# Altium schematic sheet 03-CORE_BOARD.SchDoc
size B
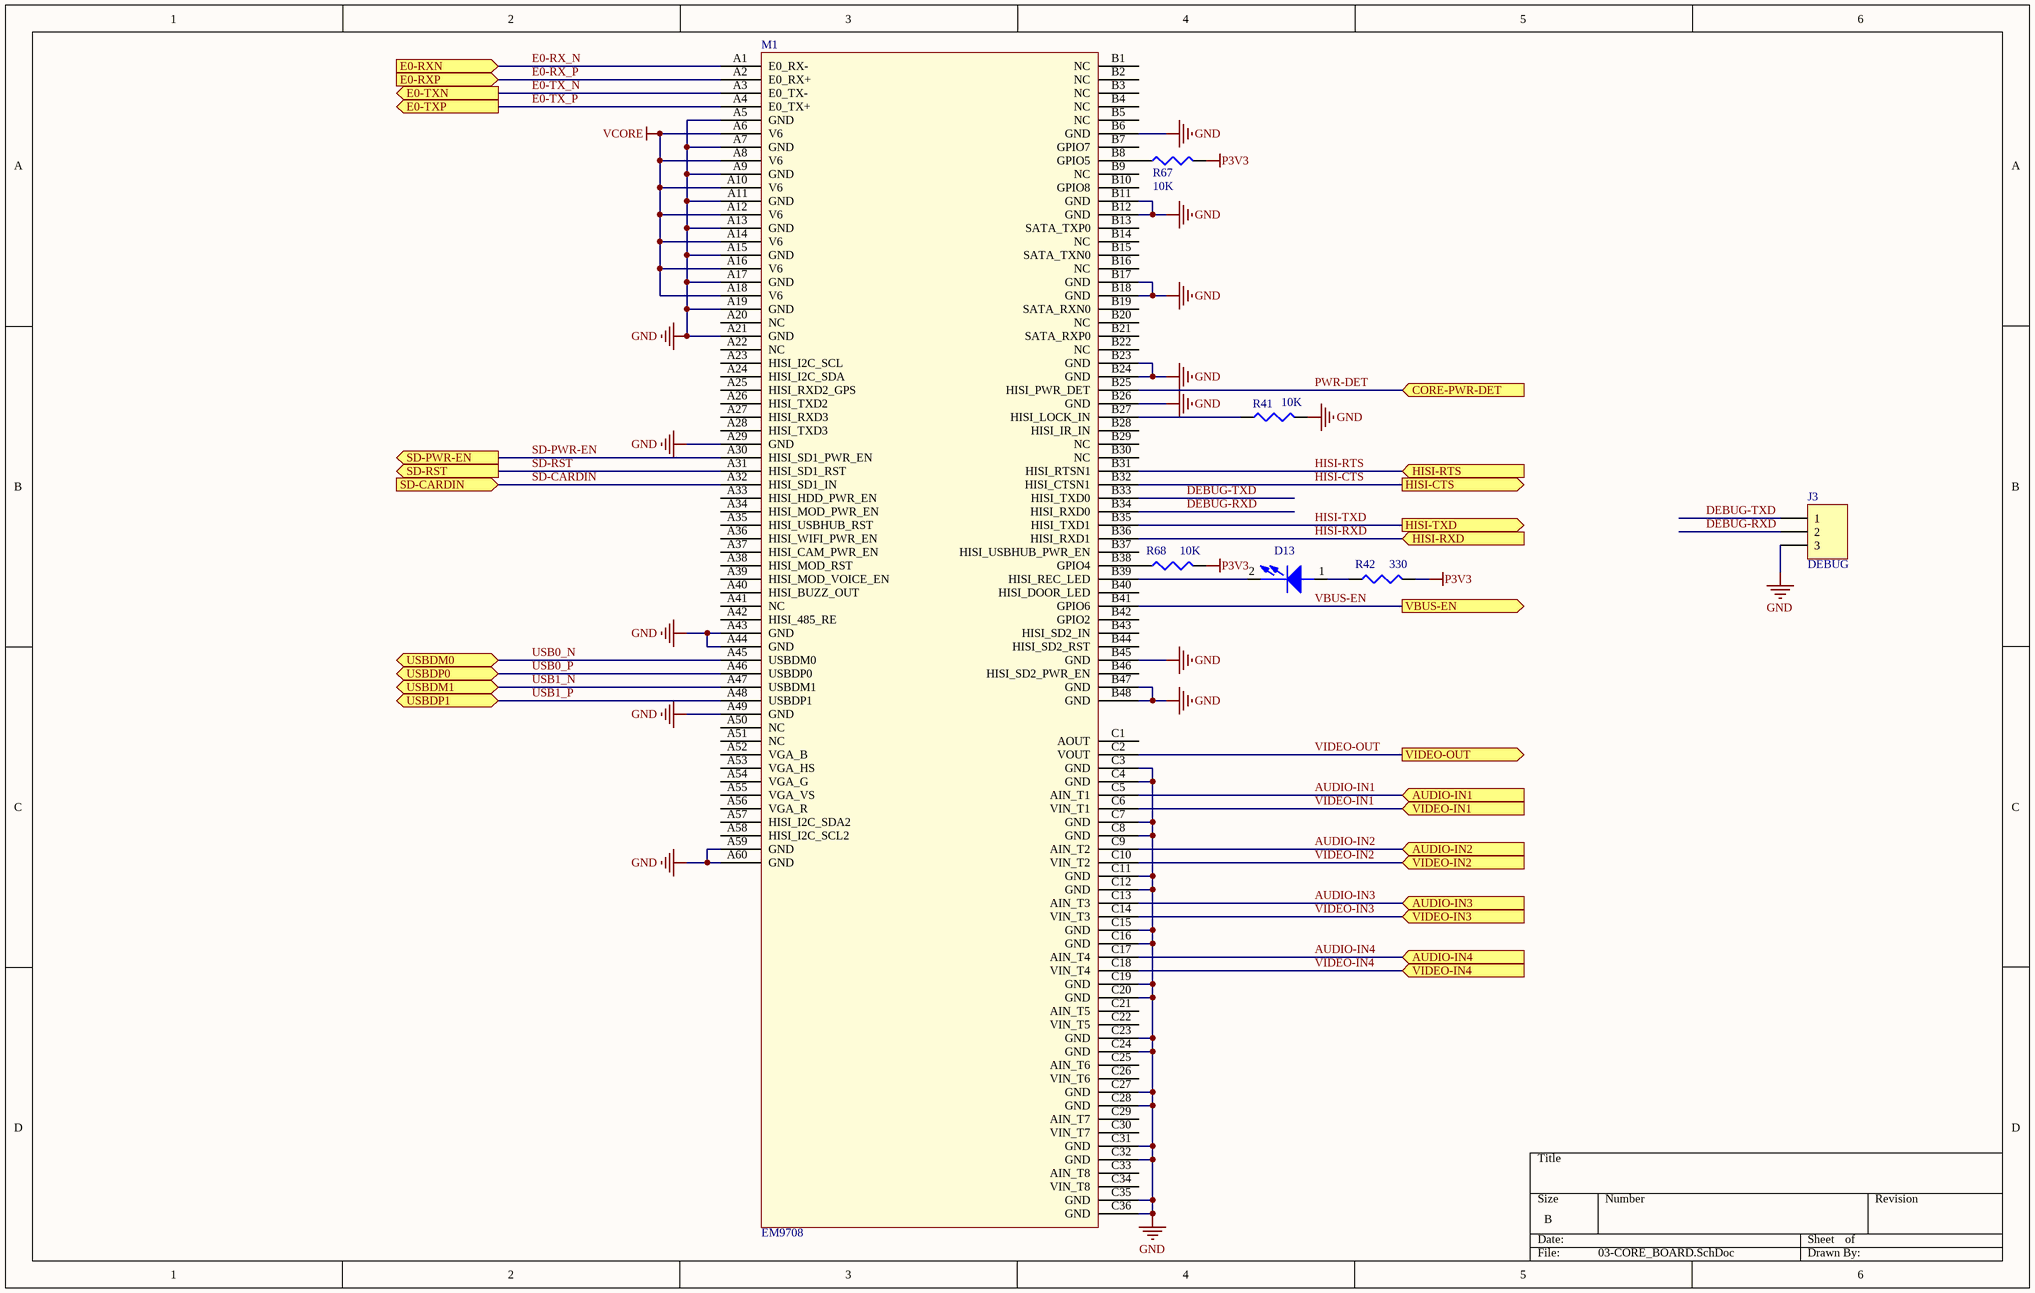
[diagram p0: 03-CORE_BOARD.SchDoc]

## Parts
D13  LED GREEN  [LED0603]  (value not drawn)
J3  DEBUG  [HDR1X3]
M1  EM9708  [EM9708]
R41  10K  [0402]
R42  330  [0402]
R67  10K  [0402]
R68  10K  [0402]

## Ports
AUDIO-IN1 (in), AUDIO-IN2 (in), AUDIO-IN3 (in), AUDIO-IN4 (in), CORE-PWR-DET (in), E0-RXN (in), E0-RXP (in), E0-TXN (out), E0-TXP (out), HISI-CTS (out), HISI-RTS (in), HISI-RXD (in), HISI-TXD (out), SD-CARDIN (in), SD-PWR-EN (out), SD-RST (out), USBDM0 (bidir), USBDM1, USBDP0 (bidir), USBDP1, VBUS-EN (out), VIDEO-IN1 (in), VIDEO-IN2 (in), VIDEO-IN3 (in), VIDEO-IN4 (in), VIDEO-OUT (out)

## Nets
GND: J3.3 M1.A5(GND) M1.A7(GND) M1.A9(GND) M1.A11(GND) M1.A13(GND) M1.A15(GND) M1.A17(GND) M1.A19(GND) M1.A21(GND) M1.A29(GND) M1.A43(GND) M1.A44(GND) M1.A49(GND) M1.A59(GND) M1.A60(GND) M1.B6(GND) M1.B11(GND) M1.B12(GND) M1.B17(GND) M1.B18(GND) M1.B23(GND) M1.B24(GND) M1.B26(GND) M1.B45(GND) M1.B47(GND) M1.B48(GND) M1.C3(GND) M1.C4(GND) M1.C7(GND) M1.C8(GND) M1.C11(GND) M1.C12(GND) M1.C15(GND) M1.C16(GND) M1.C19(GND) M1.C20(GND) M1.C23(GND) M1.C24(GND) M1.C27(GND) M1.C28(GND) M1.C31(GND) M1.C32(GND) M1.C35(GND) M1.C36(GND) R41.2
P3V3: R42.1 R67.2 R68.2
VCORE: M1.A6(V6) M1.A8(V6) M1.A10(V6) M1.A12(V6) M1.A14(V6) M1.A16(V6) M1.A18(V6)
AUDIO-IN1: M1.C5(AIN_T1) ; port AUDIO-IN1
AUDIO-IN2: M1.C9(AIN_T2) ; port AUDIO-IN2
AUDIO-IN3: M1.C13(AIN_T3) ; port AUDIO-IN3
AUDIO-IN4: M1.C17(AIN_T4) ; port AUDIO-IN4
DEBUG-RXD: J3.2 M1.B34(HISI_RXD0)
DEBUG-TXD: J3.1 M1.B33(HISI_TXD0)
E0-RX_N: M1.A1(E0_RX-) ; port E0-RXN
E0-RX_P: M1.A2(E0_RX+) ; port E0-RXP
E0-TX_N: M1.A3(E0_TX-) ; port E0-TXN
E0-TX_P: M1.A4(E0_TX+) ; port E0-TXP
HISI-CTS: M1.B32(HISI_CTSN1) ; port HISI-CTS
HISI-RTS: M1.B31(HISI_RTSN1) ; port HISI-RTS
HISI-RXD: M1.B36(HISI_RXD1) ; port HISI-RXD
HISI-TXD: M1.B35(HISI_TXD1) ; port HISI-TXD
PWR-DET: M1.B25(HISI_PWR_DET) ; port CORE-PWR-DET
SD-CARDIN: M1.A32(HISI_SD1_IN) ; port SD-CARDIN
SD-PWR-EN: M1.A30(HISI_SD1_PWR_EN) ; port SD-PWR-EN
SD-RST: M1.A31(HISI_SD1_RST) ; port SD-RST
USB0_N: M1.A45(USBDM0) ; port USBDM0
USB0_P: M1.A46(USBDP0) ; port USBDP0
USB1_N: M1.A47(USBDM1) ; port USBDM1
USB1_P: M1.A48(USBDP1) ; port USBDP1
VBUS-EN: M1.B41(GPIO6) ; port VBUS-EN
VIDEO-IN1: M1.C6(VIN_T1) ; port VIDEO-IN1
VIDEO-IN2: M1.C10(VIN_T2) ; port VIDEO-IN2
VIDEO-IN3: M1.C14(VIN_T3) ; port VIDEO-IN3
VIDEO-IN4: M1.C18(VIN_T4) ; port VIDEO-IN4
VIDEO-OUT: M1.C2(VOUT) ; port VIDEO-OUT
NetD13_1: D13.1(ANODE) R42.2
NetD13_2: D13.2(CATHODE) M1.B39(HISI_REC_LED)
NetM1_B8: M1.B8(GPIO5) R67.1
NetM1_B27: M1.B27(HISI_LOCK_IN) R41.1
NetM1_B38: M1.B38(GPIO4) R68.1

Not connected (* = marked no-connect by the designer): M1 A20(NC) A22(NC) A23(HISI_I2C_SCL) A24(HISI_I2C_SDA) A25(HISI_RXD2_GPS) A26(HISI_TXD2) A27(HISI_RXD3) A28(HISI_TXD3) A33(HISI_HDD_PWR_EN) A34(HISI_MOD_PWR_EN) A35(HISI_USBHUB_RST) A36(HISI_WIFI_PWR_EN) A37(HISI_CAM_PWR_EN) A38(HISI_MOD_RST) A39(HISI_MOD_VOICE_EN) A40(HISI_BUZZ_OUT) A41(NC) A42(HISI_485_RE) A50(NC) A51(NC) A52(VGA_B) A53(VGA_HS) A54(VGA_G) A55(VGA_VS) A56(VGA_R) A57(HISI_I2C_SDA2) A58(HISI_I2C_SCL2) B1(NC) B2(NC) B3(NC) B4(NC) B5(NC) B7(GPIO7) B9(NC) B10(GPIO8) B13(SATA_TXP0) B14(NC) B15(SATA_TXN0) B16(NC) B19(SATA_RXN0) B20(NC) B21(SATA_RXP0) B22(NC) B28(HISI_IR_IN) B29(NC) B30(NC) B37(HISI_USBHUB_PWR_EN) B40(HISI_DOOR_LED) B42(GPIO2) B43(HISI_SD2_IN) B44(HISI_SD2_RST) B46(HISI_SD2_PWR_EN) C1(AOUT) C21(AIN_T5) C22(VIN_T5) C25(AIN_T6) C26(VIN_T6) C29(AIN_T7) C30(VIN_T7) C33(AIN_T8) C34(VIN_T8)

## Library data of the parts
D13 = LN01401_1
J3 = Header 3: Header, 3-Pin; LatestRevisionDate: 17-Jul-2002; LatestRevisionNote: Re-released for DXP Platform.; Publisher: Altium Limited
R41 R67 R68 = Res3: Resistor; Value: 1K; Published: 8-Jun-2000; LatestRevisionDate: 29-May-2009; LatestRevisionNote: IPC-7351 Footprint Added.; PackageReference: J1-0603; Publisher: Altium Limited; PackageDescription: Chip Resistor
R42 = CR16-1003FM